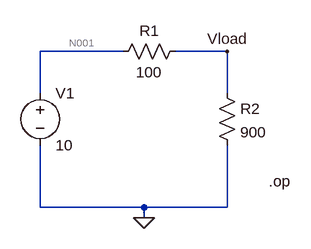
[diagram p0: schematic 190227_IEP_Ex1.asc]
190227_IEP_Ex1.asc, the LTspice schematic file:
Version 4
SHEET 1 880 680
WIRE 176 48 48 48
WIRE 336 48 256 48
WIRE 48 112 48 48
WIRE 336 112 336 48
WIRE 48 288 48 192
WIRE 208 288 48 288
WIRE 336 288 336 192
WIRE 336 288 208 288
WIRE 208 304 208 288
FLAG 208 304 0
FLAG 336 48 Vload
SYMBOL res 272 32 R90
WINDOW 0 0 56 VBottom 2
WINDOW 3 32 56 VTop 2
SYMATTR InstName R1
SYMATTR Value 100
SYMBOL res 320 96 R0
SYMATTR InstName R2
SYMATTR Value 900
SYMBOL voltage 48 96 R0
WINDOW 123 0 0 Left 0
WINDOW 39 0 0 Left 0
SYMATTR InstName V1
SYMATTR Value 10
TEXT 400 248 Left 2 !.op

The netlist it stands for:
* 190227_IEP_Ex1.asc
R1 Vload N001 100
R2 Vload 0 900
V1 N001 0 10
.op
.backanno
.end

* Results of the author's LTspice run, read from the files saved beside the schematic
* Operating Point:
*   V(vload) = 9 V
*   V(n001) = 10 V
*   I(R2) = 10 mA
*   I(R1) = -10 mA
*   I(V1) = -10 mA